# EasyEDA schematic Electrolyser_demo_Dec_2025.json
TITLE: E;ectrolyser Demo, display 1.8 Ver 0.0 Dec 2025 based on eagle; REV: 1.0; Date: 2025-12-27; Sheet: 1/1; Drawn By: AmirB; Company: Your Company
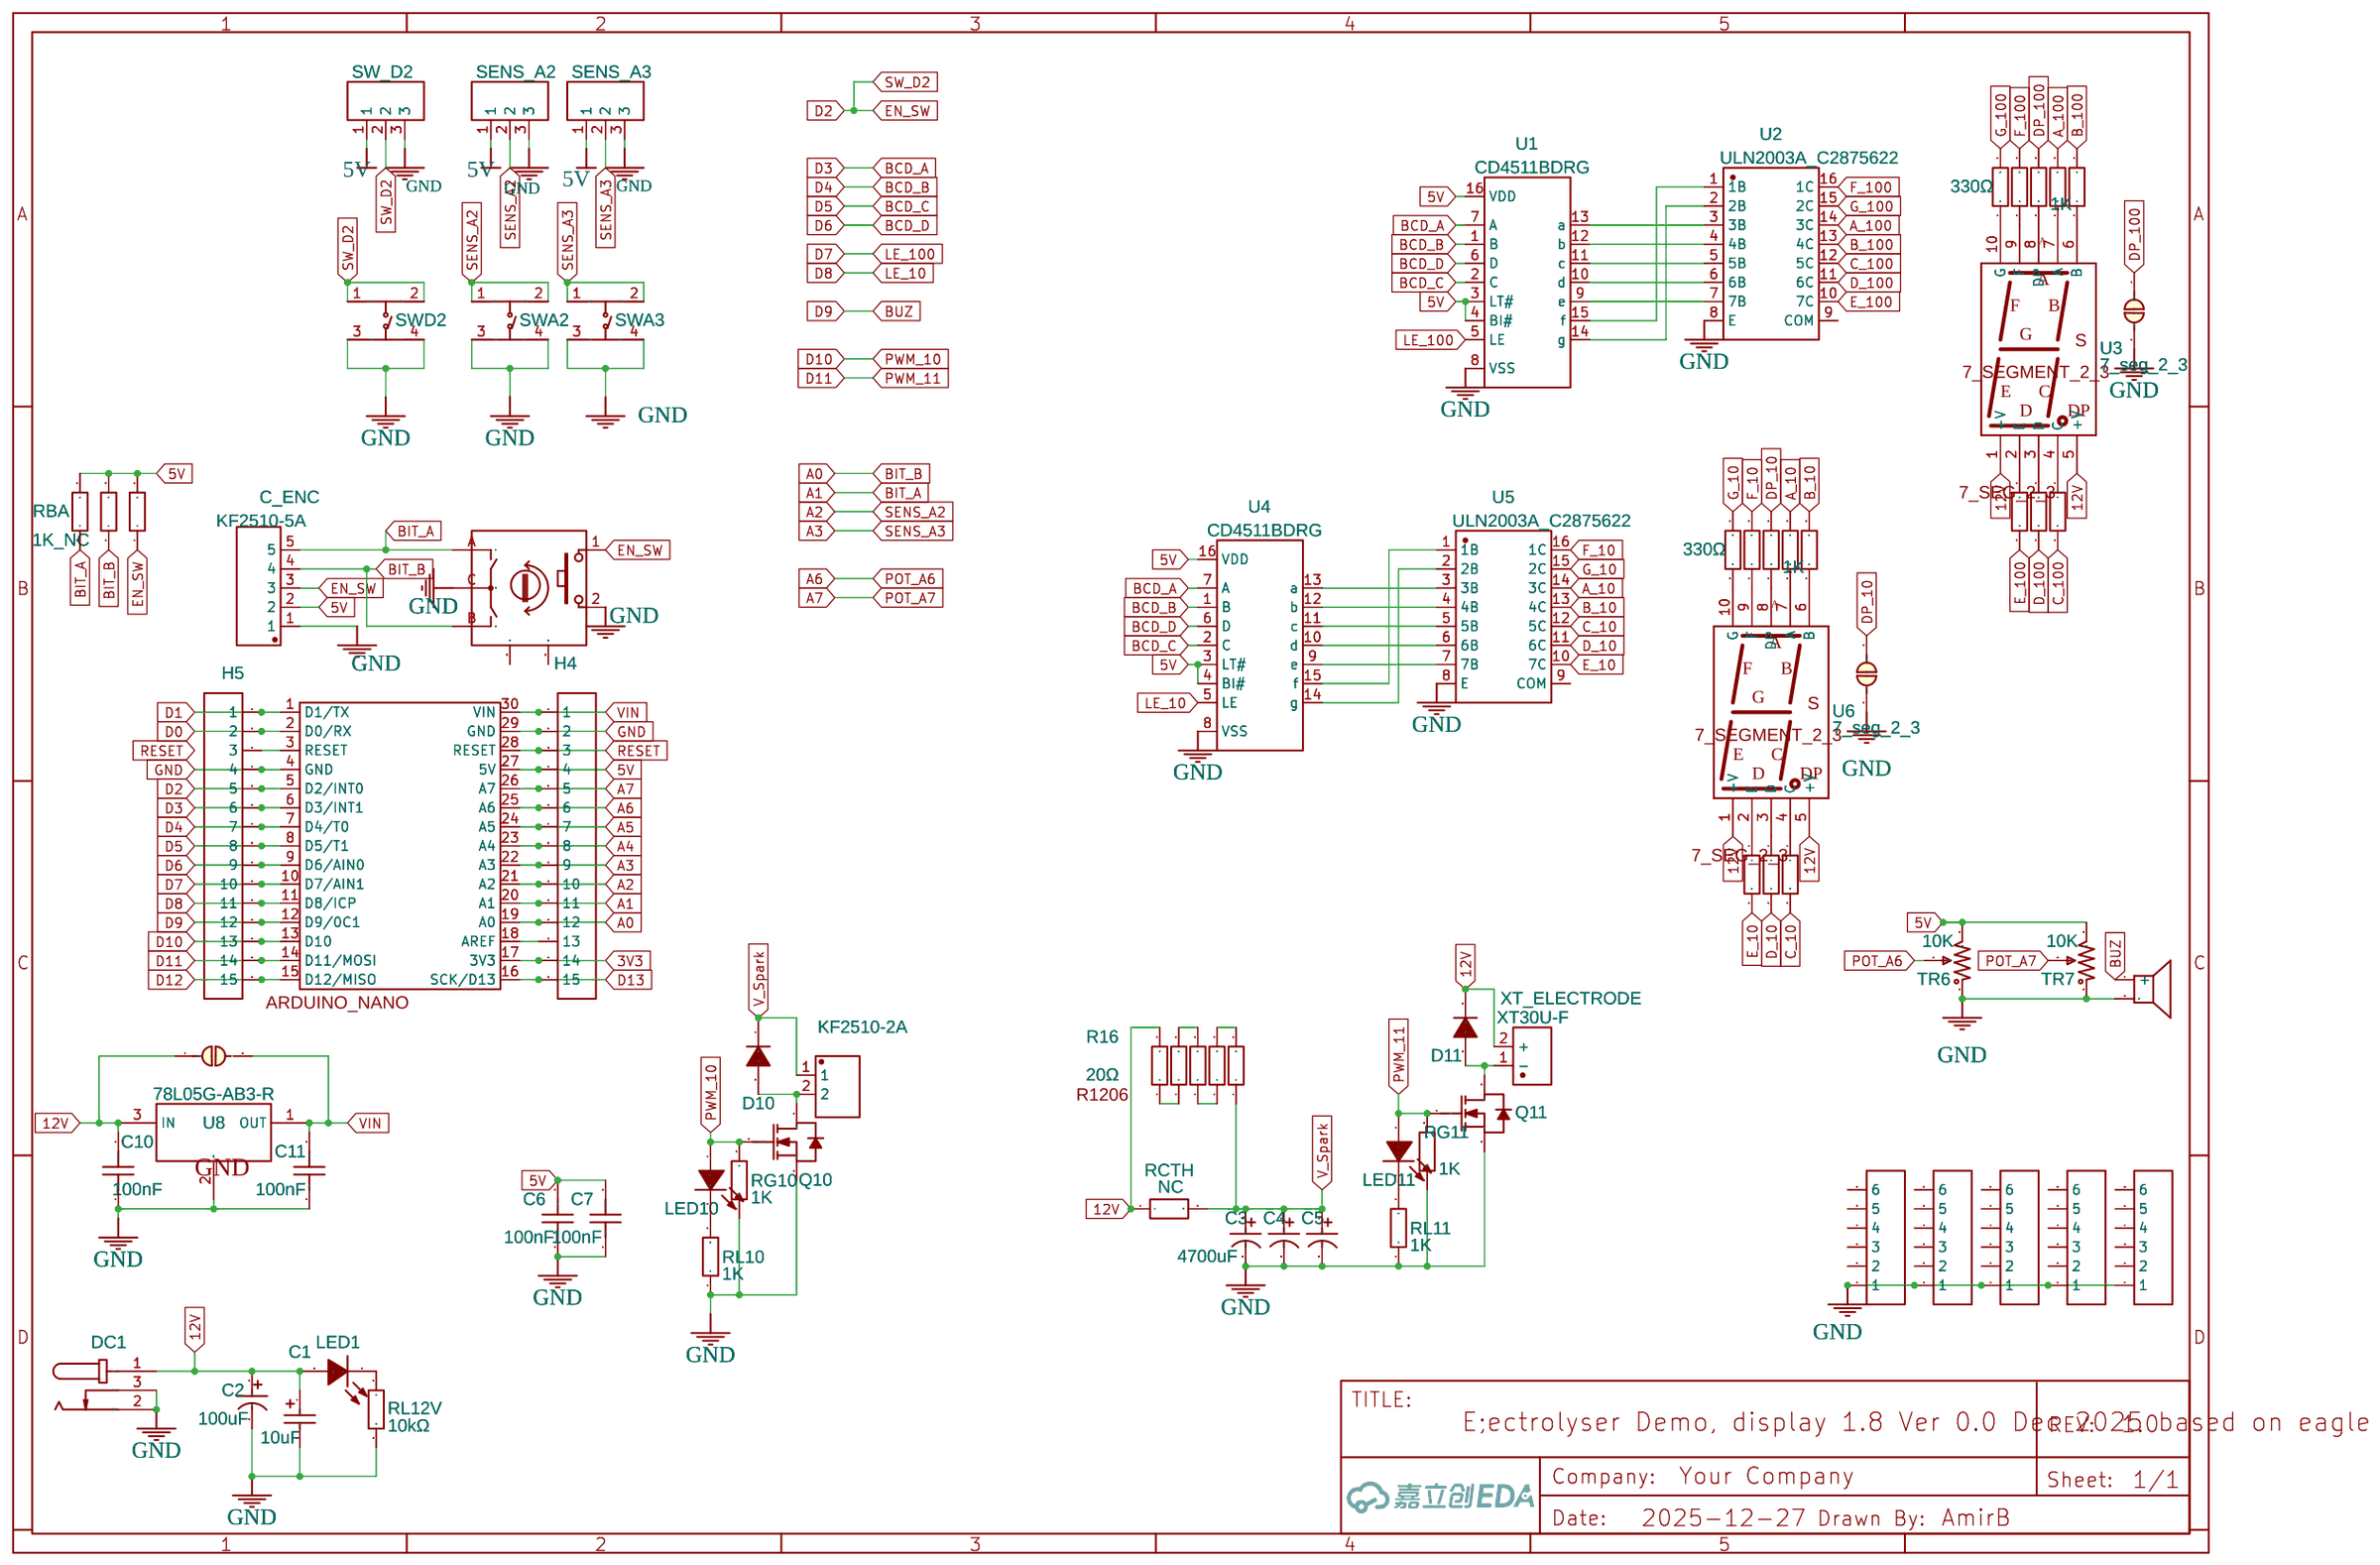
[diagram p0: schematic sheet]

## Parts
BUZZER1  BUZZER-12X9  [BUZ-TH_BD12.0-P7.60-D0.6-FD]
C1  10uF  [CAP-SMD_L3.2-W1.6-RD-C7171]
C2  100uF  [CAP-TH_BD6.3-P2.50-D1.0-FD]
C3  4700uF  [CAP-TH_BD16.0-P7.50-D1.2-FD]
C4  4700uF  [CAP-TH_BD16.0-P7.50-D1.2-FD]
C5  4700uF  [CAP-TH_BD16.0-P7.50-D1.2-FD]
C6  100nF  [C0603]
C7  100nF  [C0603]
C10  100nF  [C0603]
C11  100nF  [C0603]
C_ENC  KF2510-5A  [CONN-TH_5P-P2.54_KF2510-5A]
D10  SM4007PL  [SOD-123F_L2.8-W1.8-LS3.7-RD]
D11  SM4007PL  [SOD-123F_L2.8-W1.8-LS3.7-RD]
DC1  DC  [DC-IN-TH_DC005]
DP_10  JP  [JUMPERS_SMT-JUMPER_2_NC_PASTE_NO-SILK]
DP_100  JP  [JUMPERS_SMT-JUMPER_2_NC_PASTE_NO-SILK]
H1  HDR-F-2.54_1x6  [HDR-F-2.54_1X6]
H2  HDR-F-2.54_1x6  [HDR-F-2.54_1X6]
H3  HDR-F-2.54_1x6  [HDR-F-2.54_1X6]
H4  HDR-F-2.54_1x15  [HDR-F-2.54_1X15]
H5  HDR-F-2.54_1x15  [HDR-F-2.54_1X15]
H6  HDR-F-2.54_1x6  [HDR-F-2.54_1X6]
H11  HDR-F-2.54_1x6  [HDR-F-2.54_1X6]
J_LDO1  JP  [JUMPERS_SMT-JUMPER_2_NC_PASTE_NO-SILK]
KF_SPARK  KF2510-2A  [CONN-TH_KF2510-2A]
LED1  KT-0603R  [LED0603-RD]
LED10  0603White light_C2290  [LED0603-R-RD_WHITE]
LED11  0603White light_C2290  [LED0603-R-RD_WHITE]
Q10  IPD053N06N-DO  [TO-252-2_L6.6-W6.2-P4.57-LS10.1-BR-CW]
Q11  IPD053N06N-DO  [TO-252-2_L6.6-W6.2-P4.57-LS10.1-BR-CW]
R1  330Ω  [R0603]
R2  330Ω  [R0603]
R3  330Ω  [R0603]
R4  330Ω  [R0603]
R5  330Ω  [R0603]
R6  330Ω  [R0603]
R7  330Ω  [R0603]
R8  330Ω  [R0603]
R9  330Ω  [R0603]
R10  330Ω  [R0603]
R11  330Ω  [R0603]
R12  330Ω  [R0603]
R13  330Ω  [R0603]
R14  330Ω  [R0603]
R15  20Ω  [R1206]
R16  20Ω  [R1206]
R17  20Ω  [R1206]
R18  20Ω  [R1206]
R19  20Ω  [R1206]
R_DP_1  1K  [R0603]
R_DP_100  1K  [R0603]
RBA  1K_NC  [R0603]
RBB  1K_NC  [R0603]
RCTH  NC  [R_AXIAL-0.5]
RES  1K_NC  [R0603]
RG10  1K  [R0603]
RG11  1K  [R0603]
RL10  1K  [R0603]
RL11  1K  [R0603]
RL12V  10kΩ  [R0603]
SENS_A2  FK2510  [CONN-TH_3P-P2.00_KF2510_3A]
SENS_A3  FK2510  [CONN-TH_3P-P2.00_KF2510_3A]
SW1  PEC11R-4015F-S0024  [SW-TH_PEC11R-4XXXF-SXXXX]
SW_D2  FK2510  [CONN-TH_3P-P2.00_KF2510_3A]
SWA2  TC-6610-7-160G  [SW-TH_4P-L5.0-W5.0-P4.50-LS6.5]
SWA3  TC-6610-7-160G  [SW-TH_4P-L5.0-W5.0-P4.50-LS6.5]
SWD2  TC-6610-7-160G  [SW-TH_4P-L5.0-W5.0-P4.50-LS6.5]
TR6  10K  [RES-ADJ-TH_3296W]
TR7  10K  [RES-ADJ-TH_3296W]
U1  CD4511BDRG  [SOP-16_L10.0-W3.9-P1.27-LS6.0-BL]
U2  ULN2003A_C2875622  [SOP-16_L9.9-W3.9-P1.27-LS6.0-BL]
U3  7_seg_2_3  [7_SEG_2_3]
U4  CD4511BDRG  [SOP-16_L10.0-W3.9-P1.27-LS6.0-BL]
U5  ULN2003A_C2875622  [SOP-16_L9.9-W3.9-P1.27-LS6.0-BL]
U6  7_seg_2_3  [7_SEG_2_3]
U8  78L05G-AB3-R  [SOT-89-3_L4.5-W2.5-P1.50-LS4.2-BR]
UA  Arduino_nano  [ARDUINO_NANO]
XT_ELECTRODE  XT30U-F  [CONN-TH_XT30U-F]

## Library data of the parts
BUZZER1 = BUZZER-12X9: Contributor: lcsc; Supplier: LCSC; Supplier Part: C9900016920; Manufacturer: null; JLCPCB Part Class: Extended Part; Package Display: No
C1 = TAJA106K016RNJ: Supplier: LCSC; Manufacturer: Kyocera AVX; Supplier Part: C7171; JLCPCB Part Class: Basic Part; Package Display: No
C2 = 100uF 35V 6.3*11: Supplier: LCSC; Manufacturer: CX(承兴); Supplier Part: C19504; JLCPCB Part Class: Extended Part; Package Display: No
C3-C5 = 4700uF 25V 16*25V: Supplier: LCSC; Manufacturer: Chengx(承兴); Supplier Part: C45070; JLCPCB Part Class: Extended Part; Package Display: No
C6 C7 C10 C11 = CC0603KRX7R9BB104: JLCPCB Part Class: Basic Part; Package Display: No
C_ENC = KF2510-5A: Supplier: LCSC; Manufacturer: BOOMELE(博穆精密); Supplier Part: C27544; JLCPCB Part Class: Extended Part; Package Display: No
D10 D11 = SM4007PL: Supplier: LCSC; Manufacturer: MDD(辰达半导体); Supplier Part: C64898; JLCPCB Part Class: Basic Part; Package Display: No
DC1 = DC005-2.0MM: Supplier: LCSC; Manufacturer: SOFNG; Supplier Part: C111567; Package Display: No
DP_10 DP_100 J_LDO1 = JUMPER-SMT_2: Contributor: P-Thomsen; Package Display: No
H1-H3 H6 H11 = HDR-F-2.54_1x6: Supplier Part: C40877; Supplier: LCSC; Contributor: LCEDA_Lib; Package Display: No
H4 H5 = HDR-F-2.54_1x15: Supplier Part: C124408; Supplier: LCSC; Contributor: LCEDA_Lib; Package Display: No
KF_SPARK = KF2510-2A: Supplier: LCSC; Manufacturer: BOOMELE; Supplier Part: C27543; JLCPCB Part Class: Extended Part; Package Display: No
LED1 = KT-0603R: Supplier: LCSC; Manufacturer: KENTO; Supplier Part: C2286; JLCPCB Part Class: Basic Part; Package Display: No
LED10 LED11 = 0603White light_C2290: Supplier: LCSC; Manufacturer: KENTO; Supplier Part: C2290; JLCPCB Part Class: Basic Part; Package Display: No
Q10 Q11 = IPD053N06N-DO: Supplier: LCSC; Supplier Part: C49237805; Manufacturer: DOINGTER(杜因特); Contributor: lcsc; JLCPCB Part Class: Extended Part; Package Display: No
R1-R14 = 0603WAF3300T5E: Supplier: LCSC; Manufacturer: UNI-ROYAL(厚声); Supplier Part: C23138; JLCPCB Part Class: Basic Part; Package Display: No
R15 R17-R19 = 1206W4F200JT5E: Supplier: LCSC; Manufacturer: UNI-ROYAL(厚声); Supplier Part: C17955; JLCPCB Part Class: Basic Part; Package Display: No
R16 = 1206W4F200JT5E: Supplier: LCSC; Manufacturer: UNI-ROYAL(厚声); Supplier Part: C17955; JLCPCB Part Class: Basic Part; Package Display: Yes
R_DP_1 R_DP_100 RG10 RG11 RL10 RL11 = 0603WAF1001T5E: Supplier: LCSC; Manufacturer: UniOhm; Supplier Part: C21190; JLCPCB Part Class: Basic Part; Package Display: No
RBA RBB RES = 0603WAF1001T5E: Supplier: LCSC; Manufacturer: UniOhm; Supplier Part: C21190; Resistance (Ohms): 1K; JLCPCB Part Class: Basic Part; Package Display: No
RCTH = R_AXIAL-0.5_EU: Contributor: LCEDA_Lib; Package Display: No
RL12V = 0603WAF1002T5E: Supplier: LCSC; Manufacturer: UNI-ROYAL(厚声); Supplier Part: C25804; Resistance (Ohms): 10K; JLCPCB Part Class: Basic Part; Package Display: No
SENS_A2 SENS_A3 SW_D2 = kf2510_3A: JLCPCB Part Class: Extended Part; Package Display: No
SW1 = PEC11R-4015F-S0024: Contributor: LCSC; Supplier: LCSC; Supplier Part: C143789; Manufacturer: BOURNS; JLCPCB Part Class: Extended Part; Package Display: No
SWA2 SWA3 SWD2 = TC-6610-7-160G: Contributor: LCSC; Supplier: LCSC; Supplier Part: C2845252; Manufacturer: HCTL(华灿天禄); JLCPCB Part Class: Extended Part; Package Display: No
TR6 TR7 = 3296W-1-202LF_C49190458: Supplier: LCSC; Supplier Part: C49190458; Manufacturer: JIERR(捷而瑞); JLCPCB Part Class: Extended Part; Contributor: lcsc; Package Display: No
U1 U4 = CD4511BDRG: Contributor: lcsc; Supplier: LCSC; Supplier Part: C5145431; Manufacturer: HGC(深圳汉芯); JLCPCB Part Class: Extended Part; Package Display: No
U2 U5 = ULN2003A_C2875622: Contributor: LCSC; Supplier: LCSC; Supplier Part: C2875622; Manufacturer: LANKE(兰科); JLCPCB Part Class: Extended Part; Package Display: No
U3 U6 = 7_seg_2_3: Contributor: amirb; Package Display: Yes
U8 = 78L05G-AB3-R: Supplier: LCSC; Manufacturer: UTC(友顺); Supplier Part: C71136; JLCPCB Part Class: Basic Part; Package Display: No
UA = Arduino_nano: Contributor: amirb; Package Display: Yes
XT_ELECTRODE = XT30U-F: Contributor: lcsc; JLCPCB Part Class: Extended Part; Package Display: No

## Nets
3V3: H4.14 UA.17(3V3)
5V: C6.2 C7.2 C_ENC.2 H4.4 RBA.2 RBB.2 RES.2 SENS_A2.1 SENS_A3.1 SW_D2.1 TR6.3 TR7.3 U1.3(LT#) U1.4(BI#) U1.16(VDD) U4.3(LT#) U4.4(BI#) U4.16(VDD) UA.27(5V)
12V: C1.1 C2.1 C10.2 D11.1(C) DC1.1 J_LDO1.1 LED1.2(A) R16.2 RCTH.1 U3.1(+V) U3.5(+V) U6.1(+V) U6.5(+V) U8.3(IN) XT_ELECTRODE.2(+)
GND: BUZZER1.2 C1.2 C2.2 C3.2 C4.2 C5.2 C6.1 C7.1 C10.1 C11.1 C_ENC.1 DC1.2 DC1.3 DP_10.2 DP_100.2 H1.1 H2.1 H3.1 H4.2 H5.4 H6.1 H11.1 Q10.3(S) Q11.3(S) RG10.1 RG11.1 RL10.1 RL11.1 RL12V.2 SENS_A2.3 SENS_A3.3 SW1.2 SW1.C SW_D2.3 SWA2.3 SWA2.4 SWA3.3 SWA3.4 SWD2.3 SWD2.4 TR6.1 TR7.1 U1.8(VSS) U2.8(E) U4.8(VSS) U5.8(E) U8.2(GND) UA.4(GND) UA.29(GND)
VIN: C11.2 H4.1 J_LDO1.2 U8.1(OUT) UA.30(VIN)
A0: C_ENC.4 H4.12 RBB.1 SW1.B UA.19(A0)
A1: C_ENC.5 H4.11 RBA.1 SW1.A UA.20(A1)
A2: H4.10 SENS_A2.2 SWA2.1 SWA2.2 UA.21(A2)
A3: H4.9 SENS_A3.2 SWA3.1 SWA3.2 UA.22(A3)
A4: H4.8 UA.23(A4)
A5: H4.7 UA.24(A5)
A6: H4.6 TR6.2 UA.25(A6)
A7: H4.5 TR7.2 UA.26(A7)
A_10: R12.2 U5.14(3C)
A_100: R3.2 U2.14(3C)
B_10: R11.2 U5.13(4C)
B_100: R4.2 U2.13(4C)
BCD_A: H5.6 U1.7(A) U4.7(A) UA.6(D3/INT1)
BCD_B: H5.7 U1.1(B) U4.1(B) UA.7(D4/T0)
BCD_C: H5.8 U1.2(C) U4.2(C) UA.8(D5/T1)
BCD_D: H5.9 U1.6(D) U4.6(D) UA.9(D6/AIN0)
BUZ: BUZZER1.1(+) H5.12 UA.12(D9/0C1)
C_10: R8.2 U5.12(5C)
C_100: R7.2 U2.12(5C)
D0: H5.2 UA.2(D0/RX)
D1: H5.1 UA.1(D1/TX)
D2: C_ENC.3 H5.5 RES.1 SW1.1 SW_D2.2 SWD2.1 SWD2.2 UA.5(D2/INT0)
D7: H5.10 U1.5(LE) UA.10(D7/AIN1)
D8: H5.11 U4.5(LE) UA.11(D8/ICP)
D10: H5.13 LED10.1(A) Q10.1(G) RG10.2 UA.13(D10)
D11: H5.14 LED11.1(A) Q11.1(G) RG11.2 UA.14(D11/MOSI)
D12: H5.15 UA.15(D12/MISO)
D13: H4.15 UA.16(SCK/D13)
D_10: R9.2 U5.11(6C)
D_100: R6.2 U2.11(6C)
DP_10: DP_10.1 R_DP_1.2
DP_100: DP_100.1 R_DP_100.2
E_10: R10.2 U5.10(7C)
E_100: R5.2 U2.10(7C)
F_10: R13.2 U5.16(1C)
F_100: R2.2 U2.16(1C)
G_10: R14.2 U5.15(2C)
G_100: R1.2 U2.15(2C)
RESET: H4.3 UA.28(RESET)
V_Spark: C3.1 C4.1 C5.1 D10.1(C) KF_SPARK.1 R19.1 RCTH.2
Net-(D10-2): D10.2(A) KF_SPARK.2 Q10.2(D)
Net-(D11-2): D11.2(A) Q11.2(D) XT_ELECTRODE.1(-)
Net-(H4-13): H4.13 UA.18(AREF)
Net-(H5-3): H5.3 UA.3(RESET)
Net-(LED1-1): LED1.1(K) RL12V.1
Net-(LED10-2): LED10.2(K) RL10.2
Net-(LED11-2): LED11.2(K) RL11.2
Net-(R1-1): R1.1 U3.10(G)
Net-(R2-1): R2.1 U3.9(F)
Net-(R3-1): R3.1 U3.7(A)
Net-(R4-1): R4.1 U3.6(B)
Net-(R5-1): R5.1 U3.2(E)
Net-(R6-1): R6.1 U3.3(D)
Net-(R7-1): R7.1 U3.4(C)
Net-(R8-1): R8.1 U6.4(C)
Net-(R9-1): R9.1 U6.3(D)
Net-(R10-1): R10.1 U6.2(E)
Net-(R11-1): R11.1 U6.6(B)
Net-(R12-1): R12.1 U6.7(A)
Net-(R13-1): R13.1 U6.9(F)
Net-(R14-1): R14.1 U6.10(G)
Net-(R15-1): R15.1 R16.1
Net-(R15-2): R15.2 R17.2
Net-(R17-1): R17.1 R18.1
Net-(R18-2): R18.2 R19.2
Net-(R_DP_1-1): R_DP_1.1 U6.8(DP)
Net-(R_DP_100-1): R_DP_100.1 U3.8(DP)
Net-(U1-9): U1.9(e) U2.7(7B)
Net-(U1-10): U1.10(d) U2.6(6B)
Net-(U1-11): U1.11(c) U2.5(5B)
Net-(U1-12): U1.12(b) U2.4(4B)
Net-(U1-13): U1.13(a) U2.3(3B)
Net-(U1-14): U1.14(g) U2.2(2B)
Net-(U1-15): U1.15(f) U2.1(1B)
Net-(U4-9): U4.9(e) U5.7(7B)
Net-(U4-10): U4.10(d) U5.6(6B)
Net-(U4-11): U4.11(c) U5.5(5B)
Net-(U4-12): U4.12(b) U5.4(4B)
Net-(U4-13): U4.13(a) U5.3(3B)
Net-(U4-14): U4.14(g) U5.2(2B)
Net-(U4-15): U4.15(f) U5.1(1B)

Not connected (* = marked no-connect by the designer): H1 2 3 4 5 6; H2 2 3 4 5 6; H3 2 3 4 5 6; H6 2 3 4 5 6; H11 2 3 4 5 6; SW1 MT1 MT2; U2 9(COM); U5 9(COM)
